# EasyEDA Pro project ProPrj_封装大全尺子_2024-08-22_20-28-28_2024-11-26.epro

# Schematic 封装大全尺子
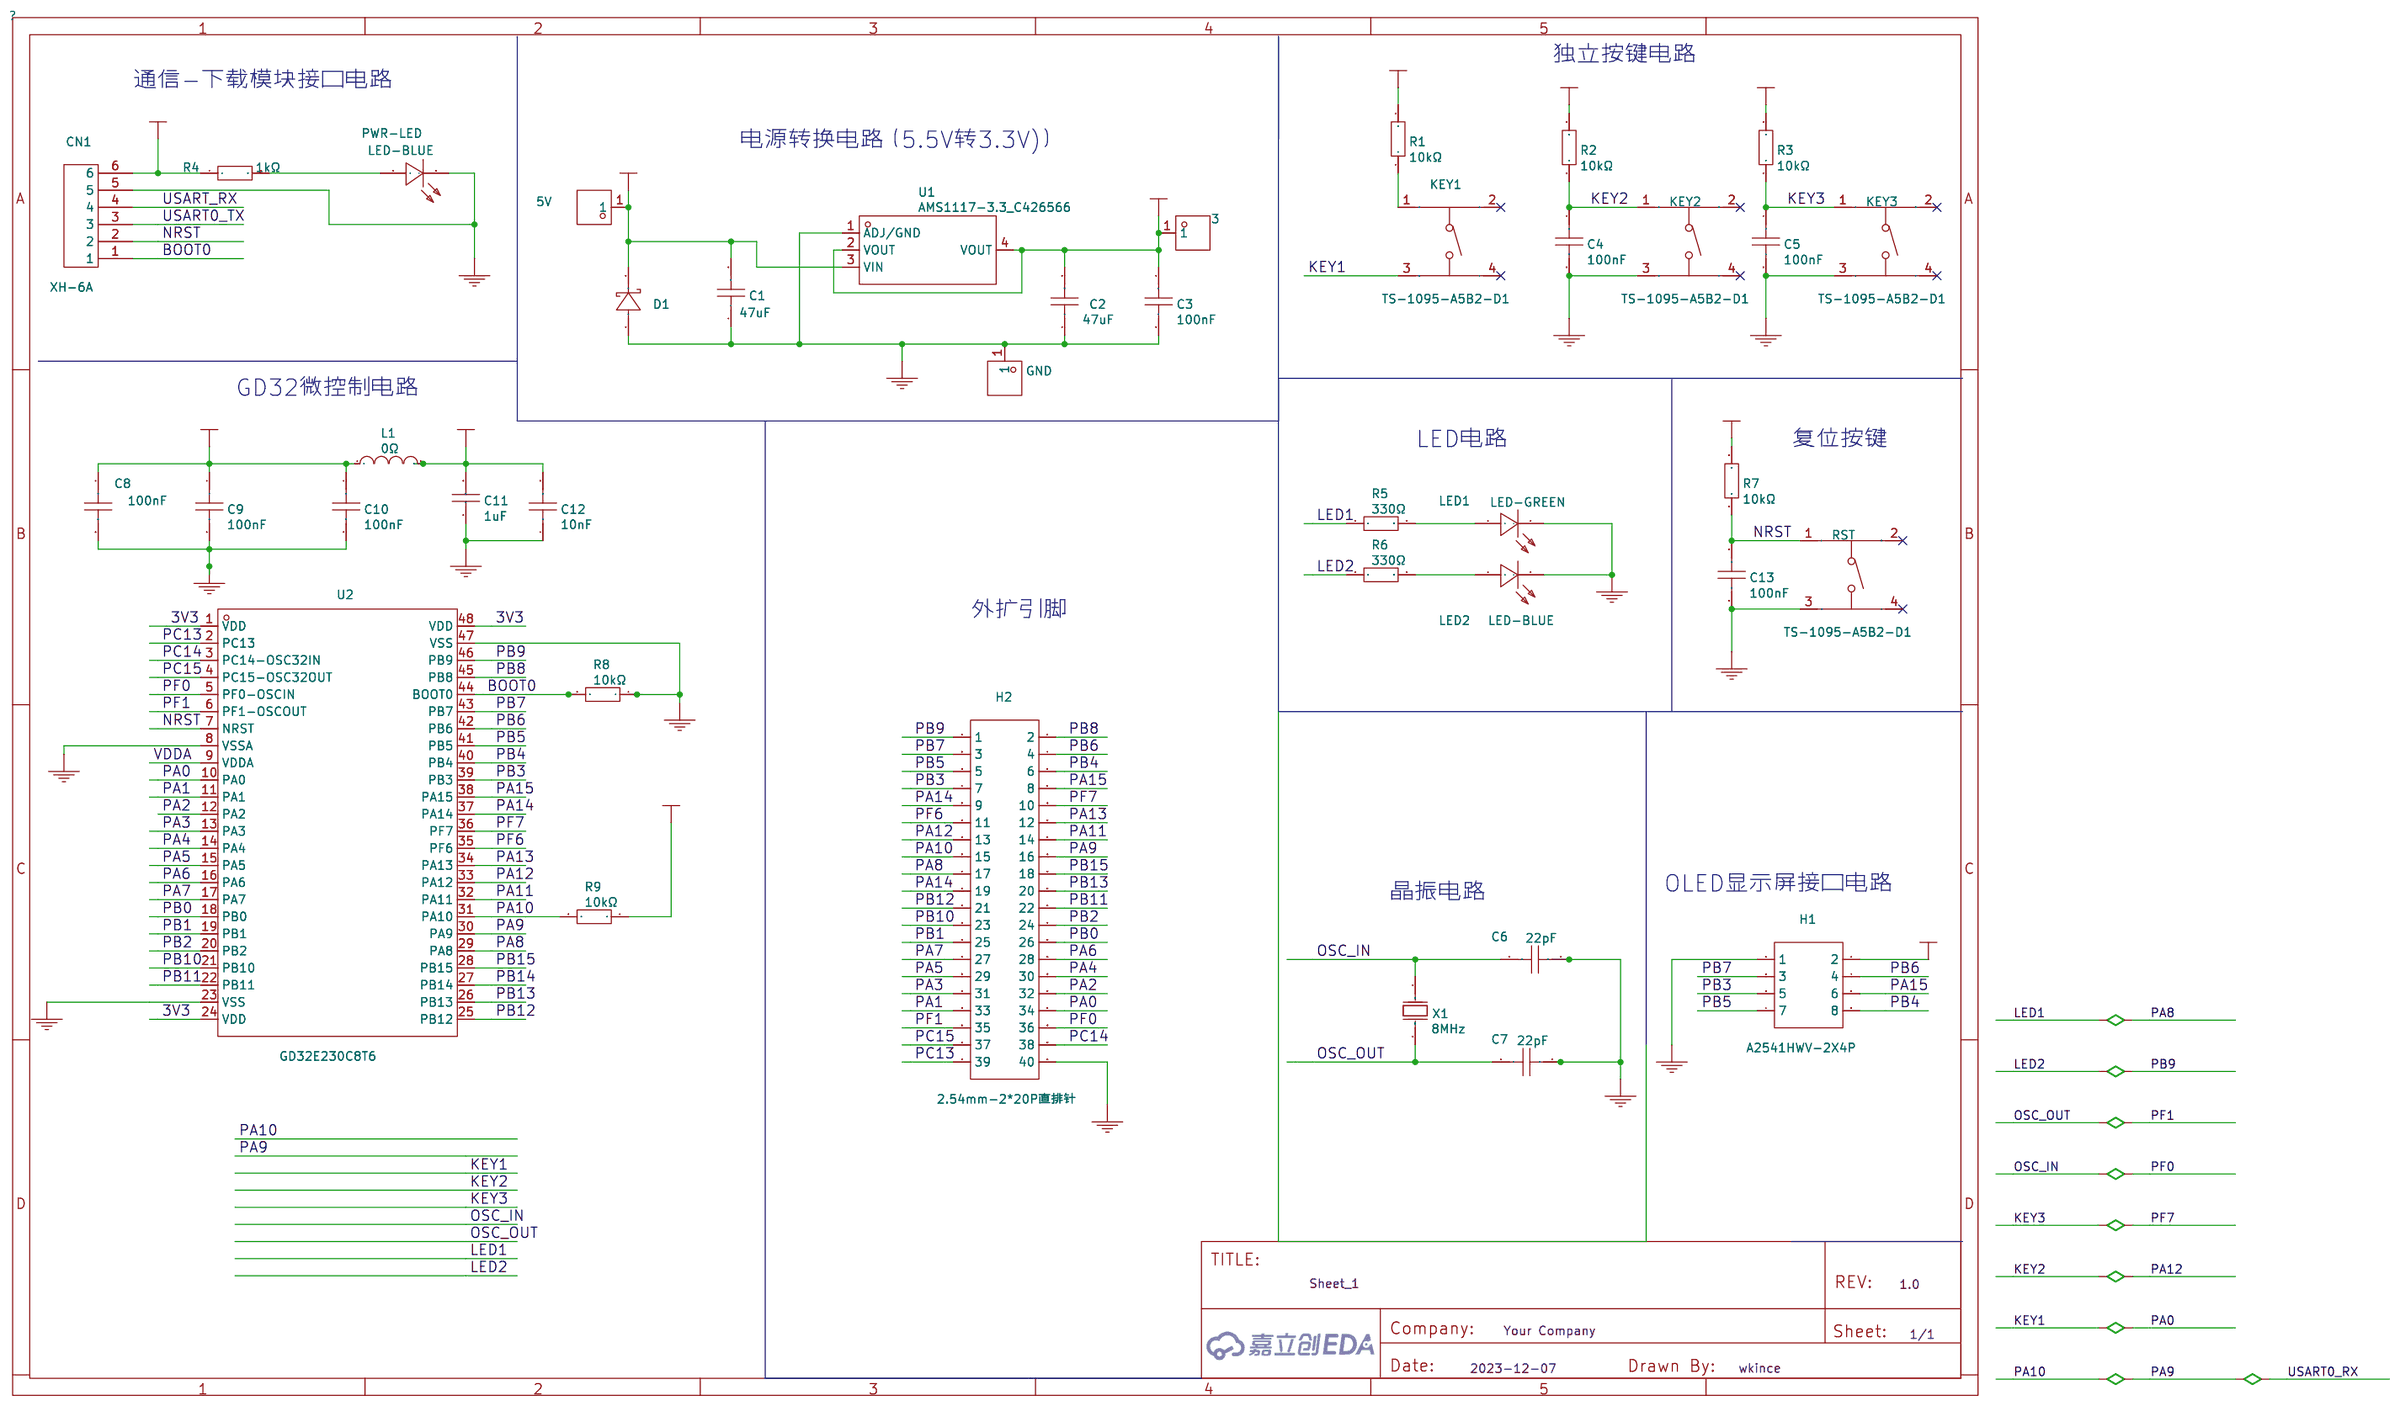
[diagram p0: schematic sheet]

## Parts
3  5010
5V  5010
C1  47uF
C2  47uF
C3  100nF
C4  100nF
C5  100nF
C6  22pF
C7  22pF
C8  100nF
C9  100nF
C10  100nF
C11  1uF
C12  10nF
C13  100nF
CN1  XH-6A
D1  SMAJ5.0A-M3/5A
GND  5010
H1  A2541HWV-2X4P
H2  2.54mm-2*20P直排针
KEY1  TS-1095-A5B2-D1
KEY2  TS-1095-A5B2-D1
KEY3  TS-1095-A5B2-D1
L1  0Ω
LED1  LED-GREEN
LED2  LED-BLUE
PWR-LED  LED-BLUE
R1  10kΩ  [R0603]
R2  10kΩ  [R0603]
R3  10kΩ  [R0603]
R4  1kΩ  [R0603]
R5  330Ω  [R0603]
R6  330Ω  [R0603]
R7  10kΩ  [R0603]
R8  10kΩ  [R0603]
R9  10kΩ  [R0603]
RST  TS-1095-A5B2-D1
U1  AMS1117-3.3_C426566
U2  GD32E230C8T6  [LQFP-48_L7.0-W7.0-P0.50-LS9.0-BL]
X1  8MHz

## Library data of the parts
3 5V GND = 5010: Supplier: LCSC; Supplier Part: C2906765; Manufacturer: Keystone; JLCPCB Part Class: Extended Part; link: https://so.szlcsc.com/global.html?k=C2906765&amp;ref=editor
C1 C2 = 47uF: Supplier: LCSC; Supplier Part: C385047; Manufacturer: muRata(村田); Manufacturer Part: GRM31CR61C476ME44L; JLCPCB Part Class: Extended Part; link: https://so.szlcsc.com/global.html?k=C385047&amp;ref=editor
C3 C8-C10 = 100nF: Supplier: LCSC; Manufacturer: YAGEO(国巨); Manufacturer Part: CC0603KRX7R9BB104; Supplier Part: C14663; JLCPCB Part Class: Basic Part; link: https://so.szlcsc.com/global.html?k=C14663&amp;ref=editor
C4 C5 C13 = 100nF: Supplier: LCSC; Manufacturer: TDK; Manufacturer Part: FA26C0G1H104JNU06; Supplier Part: C1640060; JLCPCB Part Class: Extended Part; link: https://so.szlcsc.com/global.html?k=C1640060&amp;ref=editor
C6 C7 = 22pF: Supplier: LCSC; Manufacturer: FH(风华); Manufacturer Part: 0603CG220J500NT; Supplier Part: C91701; JLCPCB Part Class: Extended Part; link: https://so.szlcsc.com/global.html?k=C91701&amp;ref=editor
C11 = 1uF: Supplier: LCSC; Manufacturer Part: CC0603KRX5R8BB105; Manufacturer: YAGEO(国巨); Supplier Part: C14664; JLCPCB Part Class: Extended Part; link: https://so.szlcsc.com/global.html?k=C14664&amp;ref=editor
C12 = 10nF: Supplier: LCSC; Supplier Part: C149618; Manufacturer: YAGEO(国巨); Manufacturer Part: AC0603KRX7R9BB103; JLCPCB Part Class: Extended Part; link: https://so.szlcsc.com/global.html?k=C149618&amp;ref=editor
CN1 = XH-6A: Supplier: LCSC; Manufacturer: BOOMELE(博穆精密); Supplier Part: C5663; JLCPCB Part Class: Extended Part; link: https://so.szlcsc.com/global.html?k=C5663&amp;ref=editor
D1 = SMAJ5.0A-M3/5A: Supplier: LCSC; Supplier Part: C1979411; Manufacturer: VISHAY(威世); JLCPCB Part Class: Extended Part; link: https://so.szlcsc.com/global.html?k=C1979411&amp;ref=editor
H1 = A2541HWV-2X4P: Supplier: LCSC; Supplier Part: C239344; Manufacturer: CJT(长江连接器); Manufacturer Part: A2541HWV-2x4P; JLCPCB Part Class: Extended Part; link: https://so.szlcsc.com/global.html?k=C239344&amp;ref=editor
H2 = 2.54mm-2*20P直排针: Supplier: LCSC; Manufacturer: BOOMELE(博穆精密); Manufacturer Part: 2.54mm 2*20P直排针; Supplier Part: C50980; JLCPCB Part Class: Extended Part; link: https://so.szlcsc.com/global.html?k=C50980&amp;ref=editor
KEY1-KEY3 RST = TS-1095-A5B2-D1: Supplier: LCSC; Supplier Part: C782808; Manufacturer: Yuandi(元迪); JLCPCB Part Class: Extended Part; link: https://so.szlcsc.com/global.html?k=C782808&amp;ref=editor
L1 = 0Ω: Supplier: LCSC; Manufacturer: FH(风华); Manufacturer Part: CBG160808U000T; Supplier Part: C43163; JLCPCB Part Class: Extended Part; link: https://so.szlcsc.com/global.html?k=C43163&amp;ref=editor
LED1 = LED-GREEN: Supplier: LCSC; Supplier Part: C434435; Manufacturer: yongyu(永裕光电); Manufacturer Part: SZYY0805YG; JLCPCB Part Class: Extended Part; link: https://so.szlcsc.com/global.html?k=C434435&amp;ref=editor
LED2 PWR-LED = LED-BLUE: Supplier: LCSC; Manufacturer: 国星光电; Manufacturer Part: NCD0805B2; Supplier Part: C84259; JLCPCB Part Class: Extended Part; link: https://so.szlcsc.com/global.html?k=C84259&amp;ref=editor
R1-R3 R7-R9 = 10kΩ: Supplier: LCSC; Manufacturer: UNI-ROYAL(厚声); Manufacturer Part: 0603WAF1002T5E; Supplier Part: C25804; JLCPCB Part Class: Basic Part; link: https://so.szlcsc.com/global.html?k=C25804&amp;ref=editor
R4 = 1kΩ: Supplier: LCSC; Manufacturer: UNI-ROYAL(厚声); Manufacturer Part: 0603WAF1001T5E; Supplier Part: C21190; JLCPCB Part Class: Basic Part; link: https://so.szlcsc.com/global.html?k=C21190&amp;ref=editor
R5 R6 = 330Ω: Supplier: LCSC; Manufacturer: UNI-ROYAL(厚声); Manufacturer Part: 0603WAF3300T5E; Supplier Part: C23138; JLCPCB Part Class: Basic Part; link: https://so.szlcsc.com/global.html?k=C23138&amp;ref=editor
U1 = AMS1117-3.3_C426566: Supplier: LCSC; Supplier Part: C426566; Manufacturer: Slkor(萨科微); Manufacturer Part: AMS1117-3.3; JLCPCB Part Class: Extended Part; link: https://so.szlcsc.com/global.html?k=C426566&amp;ref=editor
U2 = GD32E230C8T6: Supplier: LCSC; Supplier Part: C380535; Manufacturer: GigaDevice(兆易创新); JLCPCB Part Class: Extended Part; link: https://so.szlcsc.com/global.html?k=C380535&amp;ref=editor
X1 = 8MHz: Supplier: LCSC; Manufacturer: YXC(扬兴晶振); Manufacturer Part: X49SM8MSD2SC; Supplier Part: C12674; JLCPCB Part Class: Basic Part; link: https://so.szlcsc.com/global.html?k=C12674&amp;ref=editor

## Nets
3.3V: C8.1 C9.1 C10.1 L1.1 R1.2 R2.2 R3.2 R7.2 R9.1
3V3: U2.1(VDD) U2.24(VDD) U2.48(VDD)
+3.3V: 3.1 C2.2 C3.1 U1.2(VOUT) U1.4(VOUT)
+5V: 5V.1 C1.2 CN1.6 D1.2(K) H1.2 R4.1 U1.3(VIN)
GND: C1.1 C2.1 C3.2 C4.2 C5.2 C6.2 C7.2 C8.2 C9.2 C10.2 C11.1 C12.1 C13.2 CN1.5 D1.1(A) GND.1 H1.1 H2.40 KEY2.3 KEY3.3 LED1.2(-) LED2.2(-) PWR-LED.2(-) R8.1 RST.3 U1.1(ADJ/GND) U2.8(VSSA) U2.23(VSS) U2.47(VSS)
VDDA: C11.2 C12.2 L1.2 U2.9(VDDA)
BOOT0: CN1.1 R8.2 U2.44(BOOT0)
KEY1: H2.34 KEY1.3 U2.10(PA0)
KEY2: C4.1 H2.13 KEY2.1 R2.1 U2.33(PA12)
KEY3: C5.1 H2.10 KEY3.1 R3.1 U2.36(PF7)
LED1: H2.17 R5.1 U2.29(PA8)
LED2: H2.1 R6.1 U2.46(PB9)
NRST: C13.1 CN1.2 R7.1 RST.1 U2.7(NRST)
OSC_IN: C6.1 H2.36 U2.5(PF0-OSCIN) X1.1(OSC1)
OSC_OUT: C7.1 H2.35 U2.6(PF1-OSCOUT) X1.2(OSC2)
PA1: H2.33 U2.11(PA1)
PA2: H2.32 U2.12(PA2)
PA3: H2.31 U2.13(PA3)
PA4: H2.30 U2.14(PA4)
PA5: H2.29 U2.15(PA5)
PA6: H2.28 U2.16(PA6)
PA7: H2.27 U2.17(PA7)
PA10: H2.15 H2.16 R9.2 U2.30(PA9) U2.31(PA10)
PA11: H2.14 U2.32(PA11)
PA13: H2.12 U2.34(PA13)
PA14: H2.9 H2.19 U2.37(PA14)
PA15: H1.6 H2.8 U2.38(PA15)
PB0: H2.26 U2.18(PB0)
PB1: H2.25 U2.19(PB1)
PB2: H2.24 U2.20(PB2)
PB3: H1.5 H2.7 U2.39(PB3)
PB4: H1.8 H2.6 U2.40(PB4)
PB5: H1.7 H2.5 U2.41(PB5)
PB6: H1.4 H2.4 U2.42(PB6)
PB7: H1.3 H2.3 U2.43(PB7)
PB8: H2.2 U2.45(PB8)
PB10: H2.23 U2.21(PB10)
PB11: H2.22 U2.22(PB11)
PB12: H2.21 U2.25(PB12)
PB13: H2.20 U2.26(PB13)
PB14: U2.27(PB14)
PB15: H2.18 U2.28(PB15)
PC13: H2.39 U2.2(PC13)
PC14: H2.38 U2.3(PC14-OSC32IN)
PC15: H2.37 U2.4(PC15-OSC32OUT)
PF6: H2.11 U2.35(PF6)
USART0_TX: CN1.3
USART_RX: CN1.4
Net-(KEY1-1): KEY1.1 R1.1
Net-(LED1-1): LED1.1(+) R5.2
Net-(LED2-1): LED2.1(+) R6.2
Net-(PWR-LED-1): PWR-LED.1(+) R4.2

Not connected (* = marked no-connect by the designer): KEY1 2* 4*; KEY2 2* 4*; KEY3 2* 4*; RST 2* 4*

## Notes on the sheet
- 独立按键电路
- 通信-下载模块接口电路
- 电源转换电路（5.5V转3.3V)）
- GD32微控制电路
- LED电路
- 复位按键
- 外扩引脚
- OLED显示屏接口电路
- 晶振电路

# Board PCB常见封装卡
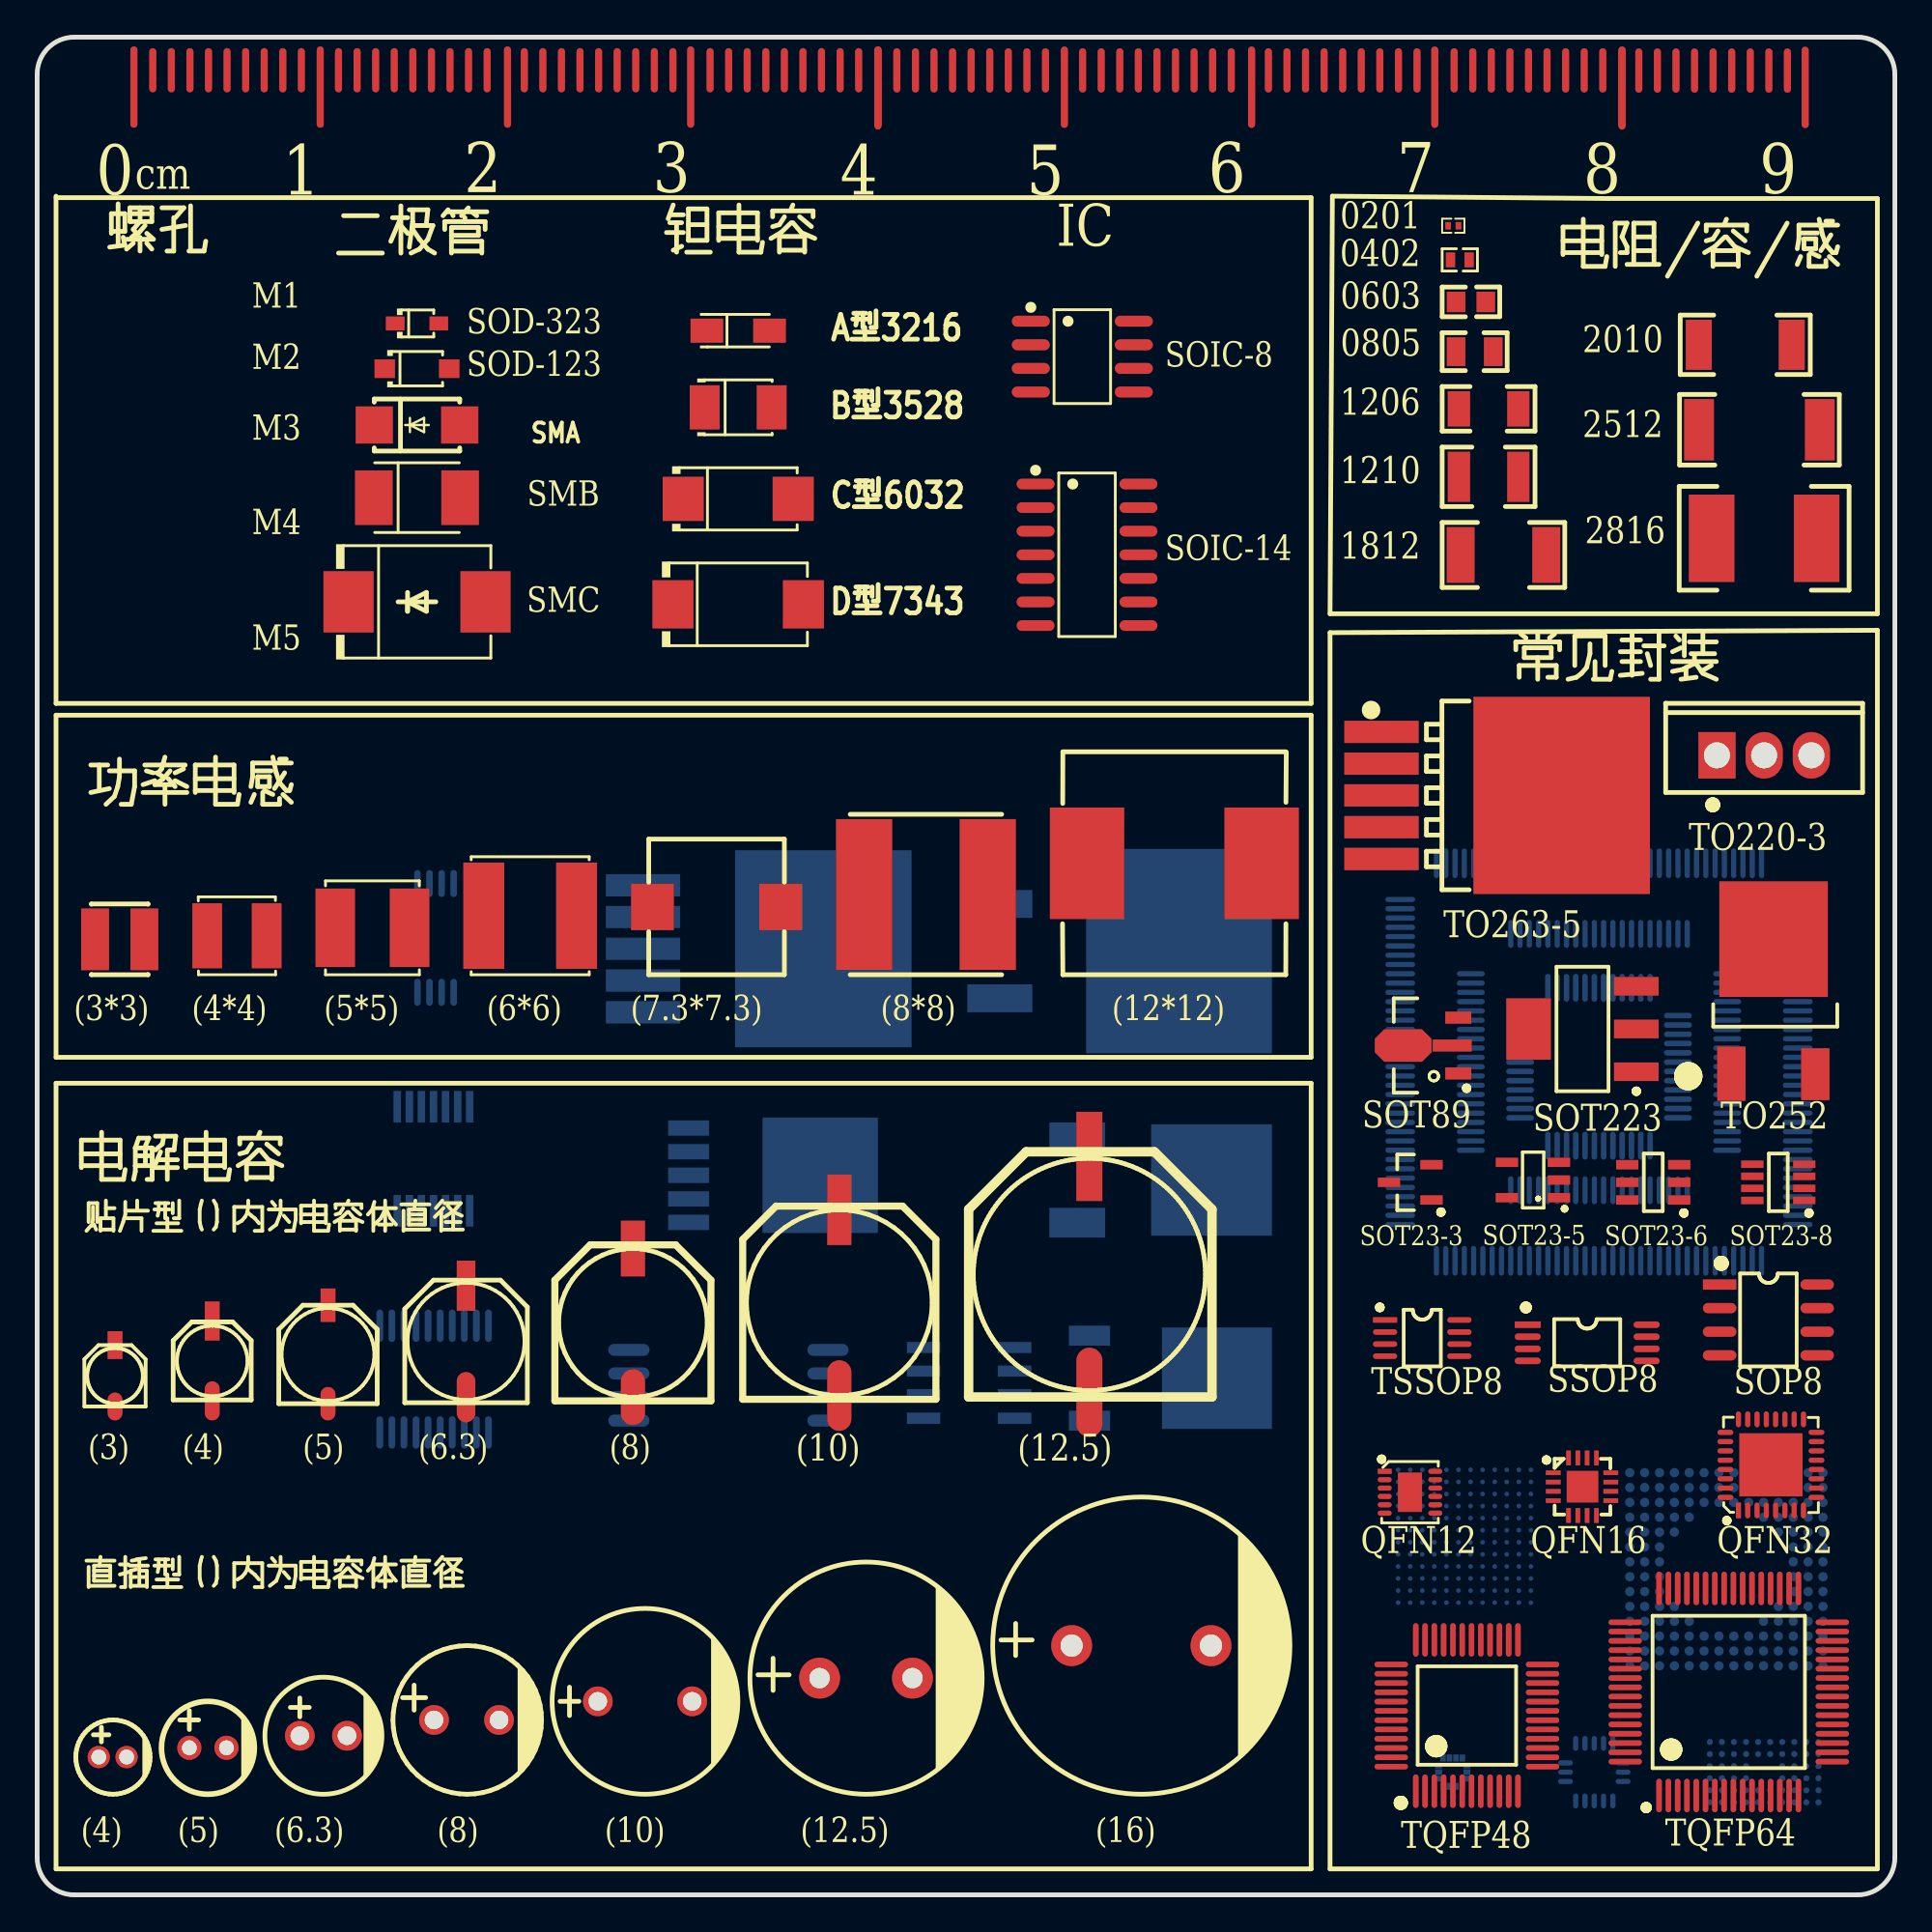
[diagram p1: board, top side]
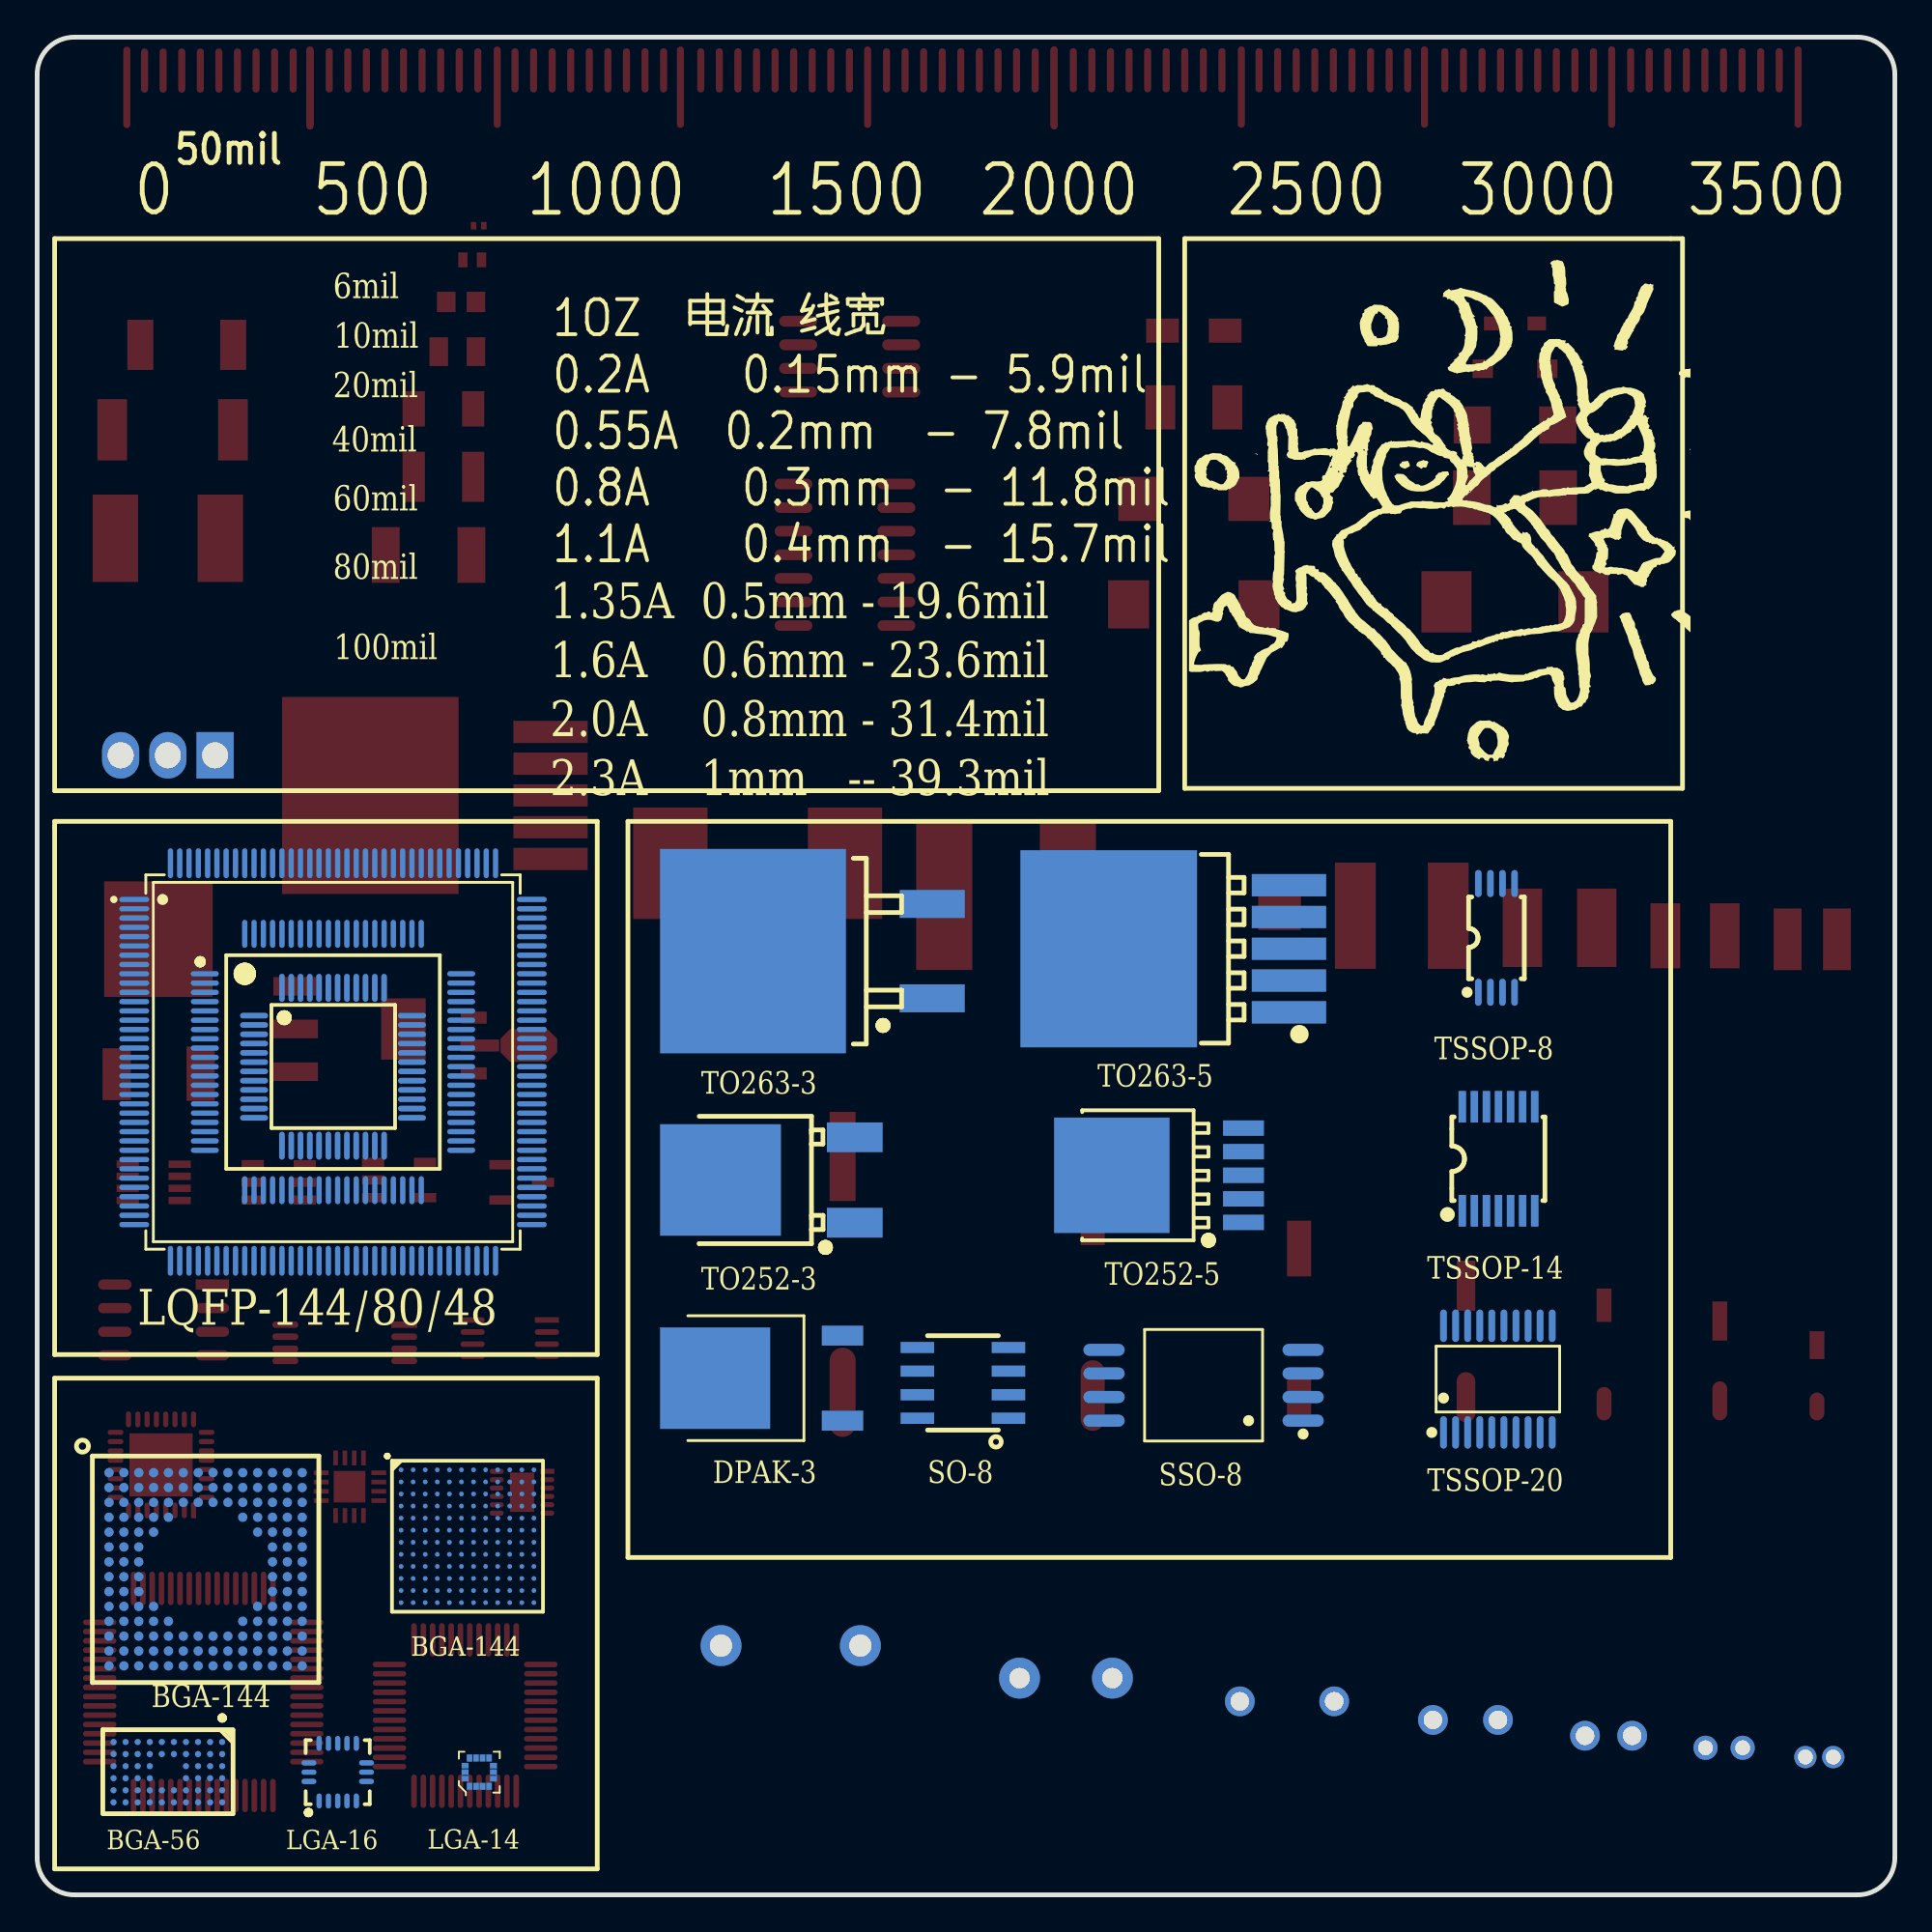
[diagram p2: board, bottom side, seen from below]

Outline 100 x 100 mm; copper layers: Top Layer, Bottom Layer. Coordinates in mm from the lower left corner of the outline.
Outline path: 0,98 arc(0.59,99.41) 2,100 98,100 arc(99.41,99.41) 100,98 100,2 arc(99.41,0.59) 98,0 2,0 arc(0.59,0.59) 0,2 0,98
Stack: Top Layer 0.035mm / Dielectric1 1.51mm FR4 er 4.5 / Bottom Layer 0.035mm

## Design rules (mm)
spacing Default (default): track to track 0.152, other pairs 0 to 0.152
track width Default (default): min 0.254, default 0.254, max 25.4
differential pair differentialPair (default): width min 0.127, default 0.254, max 2.54; gap min 0.152, default 0.152
via Default (default): diameter min 0.61, default 0.61, max 100.025; hole min 0.305, default 0.305, max 59.995
net GND uses gge54560
pour e377 uses gge54563
pour e378 uses gge54560

## Placement (name value [footprint] x y rotation side)
4*7  -  [CAP-TH_BD4.0-P1.50-D0.8-FD]  4.06 7.42 0 top
BGA-56  -  [BGA-56_L4.5-W7.0]  92.96 6.6 270 bottom
BGA-144  -  [BGA144C65P12X12_800X800X95]  76.84 19.3 180 bottom
C2  47uF  [CAP-TH_BD5.0-P2.00-D0.8-FD]  9.19 7.92 0 top
C3  100nF  [CAP-TH_BD6.3-P2.50-D1.0-FD]  15.41 8.57 0 top
C4  100nF  [CAP-TH_BD8.0-P3.50-D0.6-FD]  23.11 9.42 0 top
C5  100nF  [CAP-TH_BD12.5-P5.00-D0.6-FD]  44.62 11.67 0 top
C6  22pF  [CAP-TH_BD16.0-P7.50-D1.2-FD]  59.44 13.42 0 top
C7  22pF  [CAP-SMD_L3.2-W1.6-RD-C7171]  37.74 84.2 0 top
C8  100nF  [CAP-SMD_L3.5-W2.8]  37.74 80.07 180 top
C9  100nF  [CAP-SMD_L6.0-W3.2-R-RD]  37.74 75.15 180 top
C10  100nF  [CAP-SMD_L7.3-W4.3-R-RD]  37.74 69.47 180 top
D1  SMAJ5.0A-M3/5A  [DO-214AC_L4.3-W2.7-LS5.3-RD]  20.45 79.12 0 top
D2  -  [SOD-323_L1.8-W1.3-LS2.5-RD]  20.45 84.59 0 top
DESIGNATOR59  Comment  [CM A(3*5.4)]  4.19 27.94 270 top
DESIGNATOR60  Comment  [CM B(4*5.4)]  9.42 28.74 270 top
DESIGNATOR61  Comment  [CM C(5*5.4)]  15.66 29.09 270 top
DESIGNATOR62  Comment  [CM D(6.3*5.4)]  23.09 29.79 270 top
DESIGNATOR63  Comment  [CM E(8*10.2)]  32.07 30.79 270 top
DESIGNATOR64  Comment  [CM F(10*10.2)]  43.18 31.88 270 top
DESIGNATOR65  Comment  [CM G(12.5*13.5)]  56.64 33.4 270 top
DESIGNATOR66  Comment  [SOT23-3N]  73.91 38.35 270 top
DESIGNATOR67  Comment  [SOT23-5N]  80.52 38.48 270 top
DESIGNATOR68  Comment  [SOT23-6N]  87 38.35 270 top
DESIGNATOR69  Comment  [SOT23-8N]  93.73 38.35 270 top
DESIGNATOR70  Comment  [SOT89_N]  74.55 45.72 270 top
DESIGNATOR71  Comment  [SOT223_N]  83.19 46.61 0 top
DESIGNATOR72  Comment  [SSOP8_N]  83.44 29.72 180 top
DESIGNATOR73  Comment  [TO252]  93.47 47.24 180 top
DESIGNATOR74  Comment  [SOP8_N]  93.19 30.95 180 top
DESIGNATOR76  Comment  [TQFP48 7X7_N]  76.96 9.65 180 top
DESIGNATOR77  Comment  [TSSOP8_N]  74.56 29.97 180 top
DESIGNATOR79  Comment  [QFN32 5X5_N]  93.33 23.15 180 top
DESIGNATOR80  Comment  [QFN16_3*3]  83.19 21.97 180 top
DESIGNATOR84  Comment  [TQFP64 10X10_N]  91.06 10.92 180 top
DESIGNATOR85  Comment  [QFN12 3X3_N]  73.9 21.67 90 top
L1  0Ω  [IND-SMD_L4.0-W4.0]  10.75 51.63 0 top
L2  -  [IND-SMD_L12.0-W12.0-A]  61.21 55.53 0 top
L3  -  [IND-SMD_L6.0-W6.0]  26.54 52.71 0 top
L4  -  [IND-SMD_L3.0-W3.0]  4.44 51.44 0 top
L5  -  [IND-SMD_L8.0-W8.0]  47.84 53.85 0 top
L6  -  [IND-SMD_L7.3-W7.3]  36.57 53.18 0 top
L7  -  [IND-SMD_L5.0-W5.0]  18.05 52.06 0 top
LGA-14  -  [LGA-14_L2.0-W2.0-P0.35-BL]  76.2 6.6 180 bottom
LGA-16  -  [LGA-16_L3.0-W3.0-P0.50-BL]  83.82 6.6 180 bottom
Q1  -  [PG-TO263-3_L10.3-W9.4-P2.54-BR]  56.64 50.8 180 bottom
R1  10kΩ  [R0402]  76.58 88.01 0 top
R10  -  [R0603]  77.18 85.75 0 top
R11  -  [R0805]  77.38 83.07 0 top
R12  -  [R1206]  78.13 79.99 0 top
R13  -  [R1210]  78.13 76.33 0 top
R14  -  [R1812]  78.93 72.13 0 top
R15  -  [R2010]  91.95 83.44 0 top
R16  -  [R2512]  92.71 78.87 180 top
R17  -  [R0201]  76.23 89.85 0 top
REF1  -  [CAP-TH_BD10.0-P5.00-D1.0-FD]  32.72 10.42 0 top
RES1  -  [RES-SMD_L7.1-W4.2]  92.96 73.03 0 top
U1  AMS1117-3.3_C426566  [TO-263-5_L10.2-W9.2-P1.70-LS15.2-TL]  77.22 59.18 0 top
U2  GD32E230C8T6  [PG-TO220-3_L10.0-W4.5-P2.54-L]  92.96 61.34 0 top
U3  -  [DO-214AA_L4.4-W3.6-LS5.3-RD]  20.45 75.21 0 top
U4  -  [DO-214AB_L6.9-W5.9-LS7.9-RD]  20.45 69.6 0 top
U5  -  [SOD-123F_L2.7-W1.6-LS3.8-RD]  20.45 82.15 0 top
U6  -  [SOIC-8_L4.9-W3.9-P1.27-LS6.0-BL]  56.26 82.8 270 top
U7  -  [SOIC-14_L8.7-W3.9-P1.27-LS6.0-BL]  56.51 72.14 270 top
U8  -  [LQFP-80_L12.0-W12.0-P0.50-BL-EP]  84.07 44.83 270 bottom
U9  -  [LQFP-48_L7.0-W7.0-P0.50-LS9.0-BL]  84.07 44.58 270 bottom
U10  -  [LQFP-144_L20.0-W20.0-P0.50-LS22.0-BL]  84.07 44.83 270 bottom
U11  -  [PG-TO252-3_L6.3-W6.5-P4.57-LS10.0-BR-CW]  59.6 38.48 180 bottom
U12  -  [BGA-144_L12.1-W12.1-P0.80-BR_TMS320C5535AZHHA10]  90.93 17.53 0 bottom
U13  -  [DPAK-3_L6.6-W6.1-P2.28-LS9.9-BR]  60.08 27.81 180 bottom
U14  -  [SO-8_L4.9-W3.9-P1.27-LS6.0-BL]  50.16 27.56 90 bottom
U15  -  [SSO-8_L5.9-W6.8-P1.27-LS11.5-BL]  37.21 27.43 90 bottom
U16  -  [TO-263-5_L10.2-W9.2-P1.70-LS15.2-TL]  37.47 50.93 0 bottom
U17  -  [TO-252-5_L6.6-W5.8-P1.27-TL]  38.61 38.73 0 bottom
U18  -  [TSSOP-20_L6.5-W4.4-P0.65-LS6.4-BL]  21.37 27.76 180 bottom
U19  -  [TSSOP-8_L4.4-W3.0-P0.65-LS6.4-BL]  21.44 51.51 180 bottom
U20  -  [TSSOP-14_L5.0-W4.4-P0.65-LS6.4-BL]  21.34 39.62 180 bottom

## Footprints (pads in the part's own frame, mm; a bottom-side part is the same pattern mirrored in y, then rotated)
BGA144C65P12X12_800X800X95
  round 0.25 smd: A1(-3.575,3.575) A2(-2.925,3.575) A3(-2.275,3.575) A4(-1.625,3.575) A5(-0.975,3.575) A6(-0.325,3.575) A7(0.325,3.575) A8(0.975,3.575) A9(1.625,3.575) A10(2.275,3.575) A11(2.925,3.575) A12(3.575,3.575) B1(-3.575,2.925) B2(-2.925,2.925) B3(-2.275,2.925) B4(-1.625,2.925) B5(-0.975,2.925) B6(-0.325,2.925) B7(0.325,2.925) B8(0.975,2.925) B9(1.625,2.925) B10(2.275,2.925) B11(2.925,2.925) B12(3.575,2.925) C1(-3.575,2.275) C2(-2.925,2.275) C3(-2.275,2.275) C4(-1.625,2.275) C5(-0.975,2.275) C6(-0.325,2.275) C7(0.325,2.275) C8(0.975,2.275) C9(1.625,2.275) C10(2.275,2.275) C11(2.925,2.275) C12(3.575,2.275) D1(-3.575,1.625) D2(-2.925,1.625) D3(-2.275,1.625) D4(-1.625,1.625) D5(-0.975,1.625) D6(-0.325,1.625) D7(0.325,1.625) D8(0.975,1.625) D9(1.625,1.625) D10(2.275,1.625) D11(2.925,1.625) D12(3.575,1.625) E1(-3.575,0.975) E2(-2.925,0.975) E3(-2.275,0.975) E4(-1.625,0.975) E5(-0.975,0.975) E6(-0.325,0.975) E7(0.325,0.975) E8(0.975,0.975) E9(1.625,0.975) E10(2.275,0.975) E11(2.925,0.975) E12(3.575,0.975) F1(-3.575,0.325) F2(-2.925,0.325) F3(-2.275,0.325) F4(-1.625,0.325) F5(-0.975,0.325) F6(-0.325,0.325) F7(0.325,0.325) F8(0.975,0.325) F9(1.625,0.325) F10(2.275,0.325) F11(2.925,0.325) F12(3.575,0.325) G1(-3.575,-0.325) G2(-2.925,-0.325) G3(-2.275,-0.325) G4(-1.625,-0.325) G5(-0.975,-0.325) G6(-0.325,-0.325) G7(0.325,-0.325) G8(0.975,-0.325) G9(1.625,-0.325) G10(2.275,-0.325) G11(2.925,-0.325) G12(3.575,-0.325) H1(-3.575,-0.975) H2(-2.925,-0.975) H3(-2.275,-0.975) H4(-1.625,-0.975) H5(-0.975,-0.975) H6(-0.325,-0.975) H7(0.325,-0.975) H8(0.975,-0.975) H9(1.625,-0.975) H10(2.275,-0.975) H11(2.925,-0.975) H12(3.575,-0.975) J1(-3.575,-1.625) J2(-2.925,-1.625) J3(-2.275,-1.625) J4(-1.625,-1.625) J5(-0.975,-1.625) J6(-0.325,-1.625) J7(0.325,-1.625) J8(0.975,-1.625) J9(1.625,-1.625) J10(2.275,-1.625) J11(2.925,-1.625) J12(3.575,-1.625) K1(-3.575,-2.275) K2(-2.925,-2.275) K3(-2.275,-2.275) K4(-1.625,-2.275) K5(-0.975,-2.275) K6(-0.325,-2.275) K7(0.325,-2.275) K8(0.975,-2.275) K9(1.625,-2.275) K10(2.275,-2.275) K11(2.925,-2.275) K12(3.575,-2.275) L1(-3.575,-2.925) L2(-2.925,-2.925) L3(-2.275,-2.925) L4(-1.625,-2.925) L5(-0.975,-2.925) L6(-0.325,-2.925) L7(0.325,-2.925) L8(0.975,-2.925) L9(1.625,-2.925) L10(2.275,-2.925) L11(2.925,-2.925) L12(3.575,-2.925) M1(-3.575,-3.575) M2(-2.925,-3.575) M3(-2.275,-3.575) M4(-1.625,-3.575) M5(-0.975,-3.575) M6(-0.325,-3.575) M7(0.325,-3.575) M8(0.975,-3.575) M9(1.625,-3.575) M10(2.275,-3.575) M11(2.925,-3.575) M12(3.575,-3.575)
BGA-56_L4.5-W7.0
  round 0.33 smd: A1(-1.625,2.922) A2(-0.974,2.925) A3(-0.324,2.925) A4(0.327,2.925) A5(0.977,2.925) A6(1.625,2.925) B1(-1.625,2.275) B2(-0.974,2.275) B3(-0.324,2.275) B4(0.327,2.275) B5(0.977,2.275) B6(1.625,2.275) C1(-1.625,1.625) C2(-0.974,1.625) C3(-0.324,1.625) C4(0.327,1.625) C5(0.977,1.625) C6(1.625,1.625) D1(-1.625,0.974) D2(-0.974,0.974) D3(-0.324,0.974) D4(0.327,0.974) D5(0.977,0.974) D6(1.625,0.974) E1(-1.625,0.324) E2(-0.974,0.324) E5(0.977,0.324) E6(1.625,0.324) F1(-1.625,-0.324) F2(-0.974,-0.324) F5(0.977,-0.324) F6(1.625,-0.324) G1(-1.625,-0.974) G2(-0.974,-0.974) G3(-0.324,-0.974) G4(0.327,-0.974) G5(0.977,-0.974) G6(1.625,-0.974) H1(-1.625,-1.625) H2(-0.974,-1.625) H3(-0.324,-1.625) H4(0.327,-1.625) H5(0.977,-1.625) H6(1.625,-1.625) J1(-1.625,-2.275) J2(-0.974,-2.275) J3(-0.324,-2.275) J4(0.327,-2.275) J5(0.977,-2.275) J6(1.625,-2.275) K1(-1.625,-2.925) K2(-0.974,-2.925) K3(-0.324,-2.925) K4(0.327,-2.925) K5(0.977,-2.925) K6(1.625,-2.925)
BGA-144_L12.1-W12.1-P0.80-BR_TMS320C5535AZHHA10
  round 0.5 smd: A1(5.2,-5.2) A2(4.4,-5.2) A3(3.6,-5.2) A4(2.8,-5.2) A5(2.001,-5.2) A6(1.2,-5.2) A7(0.4,-5.2) A8(-0.4,-5.2) A9(-1.2,-5.2) A10(-2,-5.2) A11(-2.8,-5.2) A12(-3.599,-5.2) A13(-4.4,-5.2) A14(-5.2,-5.2) B1(5.2,-4.4) B2(4.4,-4.4) B3(3.6,-4.4) B4(2.8,-4.4) B5(2.001,-4.4) B6(1.2,-4.4) B7(0.4,-4.4) B8(-0.4,-4.4) B9(-1.2,-4.4) B10(-2,-4.4) B11(-2.8,-4.4) B12(-3.599,-4.4) B13(-4.4,-4.4) B14(-5.2,-4.4) C1(5.2,-3.6) C2(4.4,-3.6) C3(3.6,-3.6) C4(2.8,-3.6) C5(2.001,-3.6) C6(1.2,-3.6) C7(0.4,-3.6) C8(-0.4,-3.6) C9(-1.2,-3.6) C10(-2,-3.6) C11(-2.8,-3.6) C12(-3.599,-3.6) C13(-4.4,-3.6) C14(-5.2,-3.6) D1(5.2,-2.8) D2(4.4,-2.8) D3(3.6,-2.8) D4(2.8,-2.8) D5(2.001,-2.8) D10(-2,-2.8) D11(-2.8,-2.8) D12(-3.599,-2.8) D13(-4.4,-2.8) D14(-5.2,-2.8) E1(5.2,-2.001) E2(4.4,-2.001) E3(3.6,-2.001) E4(2.8,-2.001) E11(-2.8,-2.001) E12(-3.599,-2.001) E13(-4.4,-2.001) E14(-5.2,-2.001) F1(5.2,-1.2) F2(4.4,-1.2) F3(3.6,-1.2) F12(-3.599,-1.2) F13(-4.4,-1.2) F14(-5.2,-1.2) G1(5.2,-0.4) G2(4.4,-0.4) G3(3.6,-0.4) G12(-3.599,-0.4) G13(-4.4,-0.4) G14(-5.2,-0.4) H1(5.2,0.4) H2(4.4,0.4) H3(3.6,0.4) H12(-3.599,0.4) H13(-4.4,0.4) H14(-5.2,0.4) J1(5.2,1.2) J2(4.4,1.2) J3(3.6,1.2) J12(-3.599,1.2) J13(-4.4,1.2) J14(-5.2,1.2) K1(5.2,2) K2(4.4,2) K3(3.6,2) K4(2.8,2) K11(-2.8,2) K12(-3.599,2) K13(-4.4,2) K14(-5.2,2) L1(5.2,2.8) L2(4.4,2.8) L3(3.6,2.8) L4(2.8,2.8) L5(2.001,2.8) L10(-2,2.8) L11(-2.8,2.8) L12(-3.599,2.8) L13(-4.4,2.8) L14(-5.2,2.8) M1(5.2,3.6) M2(4.4,3.6) M3(3.6,3.6) M4(2.8,3.6) M5(2.001,3.6) M6(1.2,3.6) M7(0.4,3.6) M8(-0.4,3.6) M9(-1.2,3.6) M10(-2,3.6) M11(-2.8,3.6) M12(-3.599,3.6) M13(-4.4,3.6) M14(-5.2,3.6) N1(5.2,4.4) N2(4.4,4.4) N3(3.6,4.4) N4(2.8,4.4) N5(2.001,4.4) N6(1.2,4.4) N7(0.4,4.4) N8(-0.4,4.4) N9(-1.2,4.4) N10(-2,4.4) N11(-2.8,4.4) N12(-3.599,4.4) N13(-4.4,4.4) N14(-5.2,4.4) P1(5.2,5.2) P2(4.4,5.2) P3(3.6,5.2) P4(2.8,5.2) P5(2.001,5.2) P6(1.2,5.2) P7(0.4,5.2) P8(-0.4,5.2) P9(-1.2,5.2) P10(-2,5.2) P11(-2.8,5.2) P12(-3.599,5.2) P13(-4.4,5.2) P14(-5.2,5.2)
CAP-SMD_L3.2-W1.6-RD-C7171
  rect 1.758x1.296 smd: 1(-1.687,0) 2(1.687,0)
CAP-SMD_L3.5-W2.8
  rect 1.607x2.376 smd: 1(1.804,0) 2(-1.804,0)
CAP-SMD_L6.0-W3.2-R-RD
  rect 2.208x2.376 smd: 1(2.962,0) 2(-2.961,0)
CAP-SMD_L7.3-W4.3-R-RD
  rect 2.208x2.592 smd: 1(3.511,0) 2(-3.511,0)
CAP-TH_BD4.0-P1.50-D0.8-FD
  round 1.2 hole 0.8: 1(-0.75,0) 2(0.75,0)
CAP-TH_BD5.0-P2.00-D0.8-FD
  round 1.3 hole 0.8: 1(-1,0) 2(1,0)
CAP-TH_BD6.3-P2.50-D1.0-FD
  round 1.6 hole 1: 1(-1.27,0) 2(1.27,0)
CAP-TH_BD8.0-P3.50-D0.6-FD
  round 1.6 hole 1: 1(-1.75,0) 2(1.75,0)
CAP-TH_BD10.0-P5.00-D1.0-FD
  round 1.6 hole 1: 1(-2.54,0) 2(2.54,0)
CAP-TH_BD12.5-P5.00-D0.6-FD
  round 2.2 hole 1.1: 1(-2.5,0) 2(2.5,0)
CAP-TH_BD16.0-P7.50-D1.2-FD
  round 2.2 hole 1.2: 1(-3.75,0) 2(3.75,0)
CM A(3*5.4)
  rect 1.5x0.8 smd: 1(-1.651,0)
  oval 1.5x0.8 smd: 2(1.65,0)
CM B(4*5.4)
  rect 2.1x0.8 smd: 1(-2.15,0)
  oval 2.1x0.8 smd: 2(2.15,0)
CM C(5*5.4)
  rect 1.8x0.8 smd: 1(-2.65,0)
  oval 1.8x0.8 smd: 2(2.65,0)
CM D(6.3*5.4)
  rect 2.7x1 smd: 1(-3,0)
  oval 2.7x1 smd: 2(3,0)
CM E(8*10.2)
  rect 3x1.3 smd: 1(-4,0)
  oval 3x1.3 smd: 2(4,0)
CM F(10*10.2)
  rect 3.8x1.3 smd: 1(-5,0)
  oval 3.8x1.3 smd: 2(5,0)
CM G(12.5*13.5)
  rect 4.8x1.4 smd: 1(-6.35,0)
  oval 4.8x1.4 smd: 2(6.35,0)
DO-214AA_L4.4-W3.6-LS5.3-RD
  rect 2.024x2.94 smd: 1(-2.322,0) 2(2.322,0)
DO-214AB_L6.9-W5.9-LS7.9-RD
  rect 2.7x3.3 smd: 1(-3.687,0) 2(3.687,0)
DO-214AC_L4.3-W2.7-LS5.3-RD
  rect 2x2 smd: 1(-2.3,0) 2(2.3,0)
DPAK-3_L6.6-W6.1-P2.28-LS9.9-BR
  rect 2.223x1.071 smd: 1(3.428,-2.29) 3(3.428,2.29)
  rect 5.925x5.46 smd: 2(-3.428,0)
IND-SMD_L3.0-W3.0
  rect 1.5x3.32 smd: 1(1.328,0) 2(-1.328,0)
IND-SMD_L4.0-W4.0
  rect 1.6x3.5 smd: 1(-1.6,0) 2(1.6,0)
IND-SMD_L5.0-W5.0
  rect 2.124x4.22 smd: 1(2,0) 2(-2,0)
IND-SMD_L6.0-W6.0
  rect 2.2x5.72 smd: 1(-2.5,0) 2(2.5,0)
IND-SMD_L7.3-W7.3
  rect 2.3x2.5 smd: 1(-3.45,0) 2(3.45,0)
IND-SMD_L8.0-W8.0
  rect 3.024x8.12 smd: 1(3.328,0) 2(-3.328,0)
IND-SMD_L12.0-W12.0-A
  rect 4x6 smd: 1(-4.7,0) 2(4.7,0)
LGA-14_L2.0-W2.0-P0.35-BL
  rect 0.3x0.375 smd: 1(-0.525,-0.762) 2(-0.175,-0.762) 3(0.176,-0.762) 4(0.525,-0.762) 8(0.525,0.762) 9(0.176,0.762) 10(-0.175,0.762)
  rect 0.375x0.3 smd: 5(0.763,-0.351) 6(0.763,-0.001) 7(0.763,0.35) 12(-0.763,0.35) 13(-0.763,-0.001) 14(-0.763,-0.351)
  rect 0.3x0.38 smd: 11(-0.525,0.762)
LGA-16_L3.0-W3.0-P0.50-BL
  oval 0.28x0.8 smd: 1(-1,-1.55) 2(-0.5,-1.55) 3(0,-1.55) 4(0.5,-1.55) 5(1,-1.55) 9(1,1.55) 10(0.5,1.55) 11(0,1.55) 12(-0.5,1.55) 13(-1,1.55)
  oval 0.8x0.28 smd: 6(1.55,-0.5) 7(1.55,0) 8(1.55,0.5) 14(-1.55,0.5) 15(-1.55,0) 16(-1.55,-0.5)
LQFP-48_L7.0-W7.0-P0.50-LS9.0-BL
  oval 0.3x1.5 smd: 1(-2.75,-4.25) 2(-2.25,-4.25) 3(-1.75,-4.25) 4(-1.25,-4.25) 5(-0.75,-4.25) 6(-0.25,-4.25) 7(0.25,-4.25) 8(0.75,-4.25) 9(1.25,-4.25) 10(1.75,-4.25) 11(2.25,-4.25) 12(2.75,-4.25) 25(2.75,4.25) 26(2.25,4.25) 27(1.75,4.25) 28(1.25,4.25) 29(0.75,4.25) 30(0.25,4.25) 31(-0.25,4.25) 32(-0.75,4.25) 33(-1.25,4.25) 34(-1.75,4.25) 35(-2.25,4.25) 36(-2.75,4.25)
  oval 1.5x0.3 smd: 13(4.25,-2.75) 14(4.25,-2.25) 15(4.25,-1.75) 16(4.25,-1.25) 17(4.25,-0.75) 18(4.25,-0.25) 19(4.25,0.25) 20(4.25,0.75) 21(4.25,1.25) 22(4.25,1.75) 23(4.25,2.25) 24(4.25,2.75) 37(-4.25,2.75) 38(-4.25,2.25) 39(-4.25,1.75) 40(-4.25,1.25) 41(-4.25,0.75) 42(-4.25,0.25) 43(-4.25,-0.25) 44(-4.25,-0.75) 45(-4.25,-1.25) 46(-4.25,-1.75) 47(-4.25,-2.25) 48(-4.25,-2.75)
LQFP-80_L12.0-W12.0-P0.50-BL-EP
  oval 0.28x1.5 smd: 1(-4.75,-6.9) 2(-4.25,-6.9) 3(-3.75,-6.9) 4(-3.25,-6.9) 5(-2.75,-6.9) 6(-2.25,-6.9) 7(-1.75,-6.9) 8(-1.25,-6.9) 9(-0.75,-6.9) 10(-0.25,-6.9) 11(0.25,-6.9) 12(0.75,-6.9) 13(1.25,-6.9) 14(1.75,-6.9) 15(2.25,-6.9) 16(2.75,-6.9) 17(3.25,-6.9) 18(3.75,-6.9) 19(4.25,-6.9) 20(4.75,-6.9) 41(4.75,6.9) 42(4.25,6.9) 43(3.75,6.9) 44(3.25,6.9) 45(2.75,6.9) 46(2.25,6.9) 47(1.75,6.9) 48(1.25,6.9) 49(0.75,6.9) 50(0.25,6.9) 51(-0.25,6.9) 52(-0.75,6.9) 53(-1.25,6.9) 54(-1.75,6.9) 55(-2.25,6.9) 56(-2.75,6.9) 57(-3.25,6.9) 58(-3.75,6.9) 59(-4.25,6.9) 60(-4.75,6.9)
  oval 1.5x0.28 smd: 21(6.9,-4.75) 22(6.9,-4.25) 23(6.9,-3.75) 24(6.9,-3.25) 25(6.9,-2.75) 26(6.9,-2.25) 27(6.9,-1.75) 28(6.9,-1.25) 29(6.9,-0.75) 30(6.9,-0.25) 31(6.9,0.25) 32(6.9,0.75) 33(6.9,1.25) 34(6.9,1.75) 35(6.9,2.25) 36(6.9,2.75) 37(6.9,3.25) 38(6.9,3.75) 39(6.9,4.25) 40(6.9,4.75) 61(-6.9,4.75) 62(-6.9,4.25) 63(-6.9,3.75) 64(-6.9,3.25) 65(-6.9,2.75) 66(-6.9,2.25) 67(-6.9,1.75) 68(-6.9,1.25) 69(-6.9,0.75) 70(-6.9,0.25) 71(-6.9,-0.25) 72(-6.9,-0.75) 73(-6.9,-1.25) 74(-6.9,-1.75) 75(-6.9,-2.25) 76(-6.9,-2.75) 77(-6.9,-3.25) 78(-6.9,-3.75) 79(-6.9,-4.25) 80(-6.9,-4.75)
LQFP-144_L20.0-W20.0-P0.50-LS22.0-BL
  oval 0.28x1.6 smd: 1(-8.75,-10.7) 2(-8.25,-10.7) 3(-7.75,-10.7) 4(-7.25,-10.7) 5(-6.75,-10.7) 6(-6.25,-10.7) 7(-5.75,-10.7) 8(-5.25,-10.7) 9(-4.75,-10.7) 10(-4.25,-10.7) 11(-3.75,-10.7) 12(-3.25,-10.7) 13(-2.75,-10.7) 14(-2.25,-10.7) 15(-1.75,-10.7) 16(-1.25,-10.7) 17(-0.75,-10.7) 18(-0.25,-10.7) 19(0.25,-10.7) 20(0.75,-10.7) 21(1.25,-10.7) 22(1.75,-10.7) 23(2.25,-10.7) 24(2.75,-10.7) 25(3.25,-10.7) 26(3.75,-10.7) 27(4.25,-10.7) 28(4.75,-10.7) 29(5.25,-10.7) 30(5.75,-10.7) 31(6.25,-10.7) 32(6.75,-10.7) 33(7.25,-10.7) 34(7.75,-10.7) 35(8.25,-10.7) 36(8.75,-10.7) 73(8.75,10.7) 74(8.25,10.7) 75(7.75,10.7) 76(7.25,10.7) 77(6.75,10.7) 78(6.25,10.7) 79(5.75,10.7) 80(5.25,10.7) 81(4.75,10.7) 82(4.25,10.7) 83(3.75,10.7) 84(3.25,10.7) 85(2.75,10.7) 86(2.25,10.7) 87(1.75,10.7) 88(1.25,10.7) 89(0.75,10.7) 90(0.25,10.7) 91(-0.25,10.7) 92(-0.75,10.7) 93(-1.25,10.7) 94(-1.75,10.7) 95(-2.25,10.7) 96(-2.75,10.7) 97(-3.25,10.7) 98(-3.75,10.7) 99(-4.25,10.7) 100(-4.75,10.7) 101(-5.25,10.7) 102(-5.75,10.7) 103(-6.25,10.7) 104(-6.75,10.7) 105(-7.25,10.7) 106(-7.75,10.7) 107(-8.25,10.7) 108(-8.75,10.7)
  oval 1.6x0.28 smd: 37(10.7,-8.75) 38(10.7,-8.25) 39(10.7,-7.75) 40(10.7,-7.25) 41(10.7,-6.75) 42(10.7,-6.25) 43(10.7,-5.75) 44(10.7,-5.25) 45(10.7,-4.75) 46(10.7,-4.25) 47(10.7,-3.75) 48(10.7,-3.25) 49(10.7,-2.75) 50(10.7,-2.25) 51(10.7,-1.75) 52(10.7,-1.25) 53(10.7,-0.75) 54(10.7,-0.25) 55(10.7,0.25) 56(10.7,0.75) 57(10.7,1.25) 58(10.7,1.75) 59(10.7,2.25) 60(10.7,2.75) 61(10.7,3.25) 62(10.7,3.75) 63(10.7,4.25) 64(10.7,4.75) 65(10.7,5.25) 66(10.7,5.75) 67(10.7,6.25) 68(10.7,6.75) 69(10.7,7.25) 70(10.7,7.75) 71(10.7,8.25) 72(10.7,8.75) 109(-10.7,8.75) 110(-10.7,8.25) 111(-10.7,7.75) 112(-10.7,7.25) 113(-10.7,6.75) 114(-10.7,6.25) 115(-10.7,5.75) 116(-10.7,5.25) 117(-10.7,4.75) 118(-10.7,4.25) 119(-10.7,3.75) 120(-10.7,3.25) 121(-10.7,2.75) 122(-10.7,2.25) 123(-10.7,1.75) 124(-10.7,1.25) 125(-10.7,0.75) 126(-10.7,0.25) 127(-10.7,-0.25) 128(-10.7,-0.75) 129(-10.7,-1.25) 130(-10.7,-1.75) 131(-10.7,-2.25) 132(-10.7,-2.75) 133(-10.7,-3.25) 134(-10.7,-3.75) 135(-10.7,-4.25) 136(-10.7,-4.75) 137(-10.7,-5.25) 138(-10.7,-5.75) 139(-10.7,-6.25) 140(-10.7,-6.75) 141(-10.7,-7.25) 142(-10.7,-7.75) 143(-10.7,-8.25) 144(-10.7,-8.75)
PG-TO220-3_L10.0-W4.5-P2.54-L
  rect 2x2.5 hole 1.4: 1(-2.54,0)
  oval 2x2.5 hole 1.4: 2(0,0) 3(2.54,0)
PG-TO252-3_L6.3-W6.5-P4.57-LS10.0-BR-CW
  rect 3x1.6 smd: 1(3.614,-2.3) 3(3.614,2.299)
  rect 6.5x6 smd: 2(-3.614,0.001)
PG-TO263-3_L10.3-W9.4-P2.54-BR
  rect 3.5x1.5 smd: 1(4.824,-2.54) 3(4.824,2.54)
  rect 10x11 smd: 4(-4.824,0)
QFN12 3X3_N
  custom 0.275x0.75 smd: 1(1.125,1.361) 2(0.675,1.361) 3(0.225,1.361) 4(-0.225,1.361) 5(-0.675,1.361) 6(-1.125,1.361) 7(-1.125,-1.362) 8(-0.675,-1.362) 9(-0.225,-1.362) 10(0.225,-1.362) 11(0.675,-1.362) 12(1.125,-1.362)
  custom 2.12x1.3 smd: 13(0,0)
QFN16_3*3
  custom 0.8x0.25 smd: 1(1.575,-0.75) 2(1.575,-0.25) 3(1.575,0.25) 4(1.575,0.75) 9(-1.524,0.75) 10(-1.524,0.25) 11(-1.524,-0.25) 12(-1.524,-0.75)
  custom 0.25x0.8 smd: 5(0.75,1.55) 6(0.25,1.55) 7(-0.25,1.55) 8(-0.75,1.55) 13(-0.75,-1.55) 14(-0.25,-1.55) 15(0.25,-1.55) 16(0.75,-1.55)
  rect 1.7x1.7 smd: 17(-0.001,0)
QFN32 5X5_N
  rect 0.275x0.85 smd: 1(1.75,2.451)
  oval 0.275x0.85 smd: 2(1.25,2.451) 3(0.75,2.451) 4(0.25,2.451) 5(-0.251,2.451) 6(-0.75,2.451) 7(-1.25,2.451) 8(-1.75,2.451) 17(-1.75,-2.451) 18(-1.25,-2.451) 19(-0.75,-2.451) 20(-0.251,-2.451) 21(0.25,-2.451) 22(0.75,-2.451) 23(1.25,-2.451) 24(1.75,-2.451)
  oval 0.85x0.275 smd: 9(-2.451,1.75) 10(-2.451,1.25) 11(-2.451,0.75) 12(-2.451,0.25) 13(-2.451,-0.25) 14(-2.451,-0.75) 15(-2.451,-1.25) 16(-2.451,-1.75) 25(2.451,-1.75) 26(2.451,-1.25) 27(2.451,-0.75) 28(2.451,-0.25) 29(2.451,0.25) 30(2.451,0.75) 31(2.451,1.25) 32(2.451,1.75)
  rect 3.4x3.4 smd: 33(0,0)
R0201
  rect 0.3x0.4 smd: 1(-0.275,0) 2(0.275,0)
R0402
  rect 0.5x0.8 smd: 1(-0.5,0) 2(0.5,0)
R0603
  rect 1x1.1 smd: 1(-0.8,0) 2(0.8,0)
R0805
  rect 1x1.55 smd: 1(-1,0) 2(1,0)
R1206
  rect 1.2x1.9 smd: 1(-1.6,0) 2(1.6,0)
R1210
  rect 1.2x2.7 smd: 1(-1.6,0) 2(1.6,0)
R1812
  rect 1.5x3 smd: 1(-2.305,0) 2(2.305,0)
R2010
  rect 1.4x2.7 smd: 1(-2.5,0) 2(2.5,0)
R2512
  rect 1.6x3.3 smd: 1(-3.25,0) 2(3.25,0)
RES-SMD_L7.1-W4.2
  rect 2.45x4.7 smd: 1(-2.825,0) 2(2.825,0)
SO-8_L4.9-W3.9-P1.27-LS6.0-BL
  rect 0.6x1.8 smd: 1(-1.905,-2.45) 2(-0.635,-2.45) 3(0.635,-2.45) 4(1.905,-2.45) 5(1.905,2.45) 6(0.635,2.45) 7(-0.635,2.45) 8(-1.905,2.45)
SOD-123F_L2.7-W1.6-LS3.8-RD
  rect 1.1x1 smd: 1(-1.735,0) 2(1.735,0)
SOD-323_L1.8-W1.3-LS2.5-RD
  rect 1x0.75 smd: 1(-1.173,0) 2(1.173,0)
SOIC-8_L4.9-W3.9-P1.27-LS6.0-BL
  oval 0.588x2.045 smd: 1(-1.905,-2.772) 2(-0.635,-2.772) 3(0.635,-2.772) 4(1.905,-2.772) 5(1.905,2.772) 6(0.635,2.772) 7(-0.635,2.772) 8(-1.905,2.772)
SOIC-14_L8.7-W3.9-P1.27-LS6.0-BL
  oval 0.574x2.038 smd: 1(-3.81,-2.769) 2(-2.54,-2.769) 3(-1.27,-2.769) 4(0,-2.769) 5(1.27,-2.769) 6(2.54,-2.769) 7(3.81,-2.769) 8(3.81,2.769) 9(2.54,2.769) 10(1.27,2.769) 11(0,2.769) 12(-1.27,2.769) 13(-2.54,2.769) 14(-3.81,2.769)
SOP8_N
  custom 1.8x0.55 smd: 1(2.625,-1.905)
  custom 1.799x0.55 smd: 2(2.625,-0.635) 3(2.625,0.635) 4(2.625,1.905) 5(-2.625,1.905) 6(-2.625,0.635) 7(-2.625,-0.635) 8(-2.625,-1.905)
SOT23-3N
  custom 0.5x1.2 smd: 1(0.95,1.143) 2(-0.95,1.143) 3(0,-1.143)
SOT23-5N
  custom 0.5x1.2 smd: 1(0.95,1.4) 2(0,1.4) 3(-0.95,1.4) 4(-0.95,-1.4) 5(0.95,-1.4)
SOT23-6N
  custom 0.5x1.2 smd: 1(0.95,1.4) 2(0,1.4) 3(-0.95,1.4) 4(-0.95,-1.4) 5(0,-1.4) 6(0.95,-1.4)
SOT23-8N
  custom 0.4x1.2 smd: 1(0.975,1.397) 2(0.325,1.397) 3(-0.325,1.397) 4(-0.975,1.397) 5(-0.975,-1.397) 6(-0.325,-1.397) 7(0.325,-1.397) 8(0.975,-1.397)
SOT89_N
  custom 0.65x1.4 smd: 1(1.5,1.952) 3(-1.5,1.952)
  custom 0.65x2.1 smd: 2(0,1.625)
  custom 1.755x3.055 smd: 4(0,-1.016)
SOT223_N
  custom 2.4x1 smd: 1(2.9,-2.3) 2(2.9,0) 3(2.9,2.3)
  rect 2.4x3.3 smd: 4(-2.9,0)
SSO-8_L5.9-W6.8-P1.27-LS11.5-BL
  oval 0.65x2.216 smd: 1(-1.905,-5.359) 2(-0.635,-5.359) 3(0.635,-5.359) 4(1.905,-5.359) 5(1.905,5.359) 6(0.635,5.359) 7(-0.635,5.359) 8(-1.905,5.359)
SSOP8_N
  custom 1.4x0.35 smd: 1(3.2,-0.975) 2(3.2,-0.325) 3(3.2,0.325) 4(3.2,0.975) 5(-3.2,0.975) 6(-3.2,0.325) 7(-3.2,-0.325) 8(-3.2,-0.975)
TO252
  rect 1.524x2.921 smd: 1(2.275,3.042)
  rect 5.842x6.223 smd: 2(0,-4.2)
  rect 1.524x2.794 smd: 3(-2.247,3.067)
TO-252-5_L6.6-W5.8-P1.27-TL
  rect 2.2x0.826 smd: 1(-3.543,2.54) 2(-3.543,1.27) 3(-3.543,0) 4(-3.543,-1.27) 5(-3.543,-2.54)
  rect 6.21x6.21 smd: 6(3.543,0)
TO-263-5_L10.2-W9.2-P1.70-LS15.2-TL
  rect 4x1.2 smd: 1(-4.85,3.42) 2(-4.85,1.71) 3(-4.85,0) 4(-4.85,-1.71) 5(-4.85,-3.42)
  rect 9.5x10.608 smd: 6(4.85,0)
TQFP48 7X7_N
  custom 0.3x1.799 smd: 1(2.75,4.073) 2(2.25,4.073) 3(1.75,4.073) 4(1.25,4.073) 5(0.75,4.073) 6(0.25,4.073) 7(-0.25,4.073) 8(-0.75,4.073) 9(-1.25,4.073) 10(-1.75,4.073) 11(-2.25,4.073) 12(-2.75,4.073) 25(-2.75,-4.073) 26(-2.25,-4.073) 27(-1.75,-4.073) 28(-1.25,-4.073) 29(-0.75,-4.073) 30(-0.25,-4.073) 31(0.25,-4.073) 32(0.75,-4.073) 33(1.25,-4.073) 34(1.75,-4.073) 35(2.25,-4.073) 36(2.75,-4.073)
  custom 1.799x0.3 smd: 13(-4.073,2.75) 14(-4.073,2.25) 15(-4.073,1.75) 16(-4.073,1.25) 17(-4.073,0.75) 18(-4.073,0.25) 19(-4.073,-0.25) 20(-4.073,-0.75) 21(-4.073,-1.25) 22(-4.073,-1.75) 23(-4.073,-2.25) 24(-4.073,-2.75) 37(4.073,-2.75) 38(4.073,-2.25) 39(4.073,-1.75) 40(4.073,-1.25) 41(4.073,-0.75) 42(4.073,-0.25) 43(4.073,0.25) 44(4.073,0.75) 45(4.073,1.25) 46(4.073,1.75) 47(4.073,2.25) 48(4.073,2.75)
TQFP64 10X10_N
  custom 0.3x1.799 smd: 1(3.75,5.574) 2(3.25,5.574) 3(2.75,5.574) 4(2.25,5.574) 5(1.75,5.574) 6(1.25,5.574) 7(0.75,5.574) 8(0.25,5.574) 9(-0.25,5.574) 10(-0.75,5.574) 11(-1.25,5.574) 12(-1.75,5.574) 13(-2.25,5.574) 14(-2.75,5.574) 15(-3.25,5.574) 16(-3.75,5.574) 33(-3.75,-5.574) 34(-3.25,-5.574) 35(-2.75,-5.574) 36(-2.25,-5.574) 37(-1.75,-5.574) 38(-1.25,-5.574) 39(-0.75,-5.574) 40(-0.25,-5.574) 41(0.25,-5.574) 42(0.75,-5.574) 43(1.25,-5.574) 44(1.75,-5.574) 45(2.25,-5.574) 46(2.75,-5.574) 47(3.25,-5.574) 48(3.75,-5.574)
  custom 1.799x0.3 smd: 17(-5.574,3.75) 18(-5.574,3.25) 19(-5.574,2.75) 20(-5.574,2.25) 21(-5.574,1.75) 22(-5.574,1.25) 23(-5.574,0.75) 24(-5.574,0.25) 25(-5.574,-0.25) 26(-5.574,-0.75) 27(-5.574,-1.25) 28(-5.574,-1.75) 29(-5.574,-2.25) 30(-5.574,-2.75) 31(-5.574,-3.25) 32(-5.574,-3.75) 49(5.574,-3.75) 50(5.574,-3.25) 51(5.574,-2.75) 52(5.574,-2.25) 53(5.574,-1.75) 54(5.574,-1.25) 55(5.574,-0.75) 56(5.574,-0.25) 57(5.574,0.25) 58(5.574,0.75) 59(5.574,1.25) 60(5.574,1.75) 61(5.574,2.25) 62(5.574,2.75) 63(5.574,3.25) 64(5.574,3.75)
TSSOP8_N
  custom 1.3x0.3 smd: 1(2,-0.975)
  custom 1.299x0.3 smd: 2(2,-0.325) 3(2,0.325) 4(2,0.975) 5(-2,0.975) 6(-2,0.325) 7(-2,-0.325) 8(-2,-0.975)
TSSOP-8_L4.4-W3.0-P0.65-LS6.4-BL
  oval 0.353x1.454 smd: 1(-0.975,-2.927) 2(-0.325,-2.927) 3(0.325,-2.927) 4(0.975,-2.927) 5(0.975,2.927) 6(0.325,2.927) 7(-0.325,2.927) 8(-0.975,2.927)
TSSOP-14_L5.0-W4.4-P0.65-LS6.4-BL
  rect 0.4x1.7 smd: 1(-1.95,-2.8) 2(-1.3,-2.8) 3(-0.65,-2.8) 4(0,-2.8) 5(0.65,-2.8) 6(1.3,-2.8) 7(1.95,-2.8) 8(1.95,2.8) 9(1.3,2.8) 10(0.65,2.8) 11(0,2.8) 12(-0.65,2.8) 13(-1.3,2.8) 14(-1.95,2.8)
TSSOP-20_L6.5-W4.4-P0.65-LS6.4-BL
  oval 0.364x1.742 smd: 1(-2.925,-2.871) 2(-2.275,-2.871) 3(-1.625,-2.871) 4(-0.975,-2.871) 5(-0.325,-2.871) 6(0.325,-2.871) 7(0.975,-2.871) 8(1.625,-2.871) 9(2.275,-2.871) 10(2.925,-2.871) 11(2.925,2.871) 12(2.275,2.871) 13(1.625,2.871) 14(0.975,2.871) 15(0.325,2.871) 16(-0.325,2.871) 17(-0.975,2.871) 18(-1.625,2.871) 19(-2.275,2.871) 20(-2.925,2.871)

## Nets
As in the schematic.

Pads without a net: 4*7 1 2; BGA-56 A1 A2 A3 A4 A5 A6 B1 B2 B3 B4 B5 B6 C1 C2 C3 C4 C5 C6 D1 D2 D3 D4 D5 D6 E1 E2 E5 E6 F1 F2 F5 F6 G1 G2 G3 G4 G5 G6 H1 H2 H3 H4 H5 H6 J1 J2 J3 J4 J5 J6 K1 K2 K3 K4 K5 K6; BGA-144 A1 A2 A3 A4 A5 A6 A7 A8 A9 A10 A11 A12 B1 B2 B3 B4 B5 B6 B7 B8 B9 B10 B11 B12 C1 C2 C3 C4 C5 C6 C7 C8 C9 C10 C11 C12 D1 D2 D3 D4 D5 D6 D7 D8 D9 D10 D11 D12 E1 E2 E3 E4 E5 E6 E7 E8 E9 E10 E11 E12 F1 F2 F3 F4 F5 F6 F7 F8 F9 F10 F11 F12 G1 G2 G3 G4 G5 G6 G7 G8 G9 G10 G11 G12 H1 H2 H3 H4 H5 H6 H7 H8 H9 H10 H11 H12 J1 J2 J3 J4 J5 J6 J7 J8 J9 J10 J11 J12 K1 K2 K3 K4 K5 K6 K7 K8 K9 K10 K11 K12 L1 L2 L3 L4 L5 L6 L7 L8 L9 L10 L11 L12 M1 M2 M3 M4 M5 M6 M7 M8 M9 M10 M11 M12; C2 1 2; C3 1 2; C4 1 2; C5 1 2; C6 1 2; C7 1 2; C8 1 2; C9 1 2; C10 1 2; D1 1 2; D2 1 2; DESIGNATOR59 1 2; DESIGNATOR60 1 2; DESIGNATOR61 1 2; DESIGNATOR62 1 2; DESIGNATOR63 1 2; DESIGNATOR64 1 2; DESIGNATOR65 1 2; DESIGNATOR66 1 2 3; DESIGNATOR67 1 2 3 4 5; DESIGNATOR68 1 2 3 4 5 6; DESIGNATOR69 1 2 3 4 5 6 7 8; DESIGNATOR70 1 2 3 4; DESIGNATOR71 1 2 3 4; DESIGNATOR72 1 2 3 4 5 6 7 8; DESIGNATOR73 1 2 3; DESIGNATOR74 1 2 3 4 5 6 7 8; DESIGNATOR76 1 2 3 4 5 6 7 8 9 10 11 12 13 14 15 16 17 18 19 20 21 22 23 24 25 26 27 28 29 30 31 32 33 34 35 36 37 38 39 40 41 42 43 44 45 46 47 48; DESIGNATOR77 1 2 3 4 5 6 7 8; DESIGNATOR79 1 2 3 4 5 6 7 8 9 10 11 12 13 14 15 16 17 18 19 20 21 22 23 24 25 26 27 28 29 30 31 32 33; DESIGNATOR80 1 2 3 4 5 6 7 8 9 10 11 12 13 14 15 16 17; DESIGNATOR84 1 2 3 4 5 6 7 8 9 10 11 12 13 14 15 16 17 18 19 20 21 22 23 24 25 26 27 28 29 30 31 32 33 34 35 36 37 38 39 40 41 42 43 44 45 46 47 48 49 50 51 52 53 54 55 56 57 58 59 60 61 62 63 64; DESIGNATOR85 1 2 3 4 5 6 7 8 9 10 11 12 13; L1 1 2; L2 1 2; L3 1 2; L4 1 2; L5 1 2; L6 1 2; L7 1 2; LGA-14 1 2 3 4 5 6 7 8 9 10 11 12 13 14; LGA-16 1 2 3 4 5 6 7 8 9 10 11 12 13 14 15 16; Q1 1 3 4; R1 1 2; R10 1 2; R11 1 2; R12 1 2; R13 1 2; R14 1 2; R15 1 2; R16 1 2; R17 1 2; REF1 1 2; RES1 1 2; U1 1 2 3 4 5 6; U2 1 2 3; U3 1 2; U4 1 2; U5 1 2; U6 1 2 3 4 5 6 7 8; U7 1 2 3 4 5 6 7 8 9 10 11 12 13 14; U8 1 2 3 4 5 6 7 8 9 10 11 12 13 14 15 16 17 18 19 20 21 22 23 24 25 26 27 28 29 30 31 32 33 34 35 36 37 38 39 40 41 42 43 44 45 46 47 48 49 50 51 52 53 54 55 56 57 58 59 60 61 62 63 64 65 66 67 68 69 70 71 72 73 74 75 76 77 78 79 80; U9 1 2 3 4 5 6 7 8 9 10 11 12 13 14 15 16 17 18 19 20 21 22 23 24 25 26 27 28 29 30 31 32 33 34 35 36 37 38 39 40 41 42 43 44 45 46 47 48; U10 1 2 3 4 5 6 7 8 9 10 11 12 13 14 15 16 17 18 19 20 21 22 23 24 25 26 27 28 29 30 31 32 33 34 35 36 37 38 39 40 41 42 43 44 45 46 47 48 49 50 51 52 53 54 55 56 57 58 59 60 61 62 63 64 65 66 67 68 69 70 71 72 73 74 75 76 77 78 79 80 81 82 83 84 85 86 87 88 89 90 91 92 93 94 95 96 97 98 99 100 101 102 103 104 105 106 107 108 109 110 111 112 113 114 115 116 117 118 119 120 121 122 123 124 125 126 127 128 129 130 131 132 133 134 135 136 137 138 139 140 141 142 143 144; U11 1 2 3; U12 A1 A2 A3 A4 A5 A6 A7 A8 A9 A10 A11 A12 A13 A14 B1 B2 B3 B4 B5 B6 B7 B8 B9 B10 B11 B12 B13 B14 C1 C2 C3 C4 C5 C6 C7 C8 C9 C10 C11 C12 C13 C14 D1 D2 D3 D4 D5 D10 D11 D12 D13 D14 E1 E2 E3 E4 E11 E12 E13 E14 F1 F2 F3 F12 F13 F14 G1 G2 G3 G12 G13 G14 H1 H2 H3 H12 H13 H14 J1 J2 J3 J12 J13 J14 K1 K2 K3 K4 K11 K12 K13 K14 L1 L2 L3 L4 L5 L10 L11 L12 L13 L14 M1 M2 M3 M4 M5 M6 M7 M8 M9 M10 M11 M12 M13 M14 N1 N2 N3 N4 N5 N6 N7 N8 N9 N10 N11 N12 N13 N14 P1 P2 P3 P4 P5 P6 P7 P8 P9 P10 P11 P12 P13 P14; U13 1 2 3; U14 1 2 3 4 5 6 7 8; U15 1 2 3 4 5 6 7 8; U16 1 2 3 4 5 6; U17 1 2 3 4 5 6; U18 1 2 3 4 5 6 7 8 9 10 11 12 13 14 15 16 17 18 19 20; U19 1 2 3 4 5 6 7 8; U20 1 2 3 4 5 6 7 8 9 10 11 12 13 14

## Routing (per net, layer and track width the routed paths; a pad name or vN(x,y) marks a point on that pad's centre or on a via; arc(x,y) is an arc through that point)
S$49: length 218
  Top Layer w0.381: 70.28,97.21 70.28,99.21 ; 32.22,97.22 32.22,99.22 ; 50.28,97.21 50.28,99.21 ; 10.22,97.22 10.22,99.22 ; 52.28,97.21 52.28,99.21 ; 86.22,97.2 86.22,99.2 ; 48.28,97.21 48.28,99.21 ; 90.22,97.2 90.22,99.2 ; 85.31,95.31 85.31,99.31 ; 53.28,97.21 53.28,99.21 ; 24.22,97.22 24.22,99.22 ; 83.28,97.21 83.28,99.21 ; 63.28,97.21 63.28,99.21 ; 61.28,97.21 61.28,99.21 ; 77.28,97.21 77.28,99.21 ; 72.28,97.21 72.28,99.21 ; 79.28,97.21 79.28,99.21 ; 64.28,97.21 64.28,99.21 ; 45.26,95.31 45.26,99.31 ; 11.22,97.22 11.22,99.22 ; 36.22,97.22 36.22,99.22 ; 75.23,95.31 75.23,99.31 ; 85.31,95.3 85.31,99.3 ; 60.28,97.21 60.28,99.21 ; 95.17,95.3 95.17,99.3 ; 21.22,97.22 21.22,99.22 ; 94.22,97.2 94.22,99.2 ; 14.22,97.22 14.22,99.22 ; 76.28,97.21 76.28,99.21 ; 26.22,97.22 26.22,99.22 ; 43.22,97.22 43.22,99.22 ; 65.37,95.31 65.37,99.31 ; 66.28,97.21 66.28,99.21 ; 39.22,97.22 39.22,99.22 ; 57.28,97.21 57.28,99.21 ; 19.22,97.22 19.22,99.22 ; 37.22,97.22 37.22,99.22 ; 51.28,97.21 51.28,99.21 ; 58.28,97.21 58.28,99.21 ; 20.22,97.22 20.22,99.22 ; 42.22,97.22 42.22,99.22 ; 82.28,97.21 82.28,99.21 ; 7.22,97.22 7.22,99.22 ; 29.22,97.22 29.22,99.22 ; 80.28,97.21 80.28,99.21 ; 92.22,97.2 92.22,99.2 ; 18.22,97.22 18.22,99.22 ; 87.22,97.2 87.22,99.2 ; 91.22,97.2 91.22,99.2 ; 28.22,97.22 28.22,99.22 ; 93.22,97.2 93.22,99.2 ; 44.22,97.22 44.22,99.22 ; 67.28,97.21 67.28,99.21 ; 81.28,97.21 81.28,99.21 ; 23.22,97.22 23.22,99.22 ; 5.21,95.31 5.21,99.31 ; 45.26,95.22 45.26,99.22 ; 34.22,97.22 34.22,99.22 ; 73.28,97.21 73.28,99.21 ; 56.28,97.21 56.28,99.21 ; 62.28,97.21 62.28,99.21 ; 45.26,95.31 45.26,99.31 ; 30.22,97.22 30.22,99.22 ; 12.22,97.22 12.22,99.22 ; 78.28,97.21 78.28,99.21 ; 88.22,97.2 88.22,99.2 ; 33.22,97.22 33.22,99.22 ; 46.28,97.21 46.28,99.21 ; 13.22,97.22 13.22,99.22 ; 85.31,95.21 85.31,99.21 ; 25.32,95.31 25.32,99.31 ; 31.22,97.22 31.22,99.22 ; 16.22,97.22 16.22,99.22 ; 84.28,97.21 84.28,99.21 ; 71.28,97.21 71.28,99.21 ; 89.22,97.2 89.22,99.2 ; 55.29,95.31 55.29,99.31 ; 9.22,97.22 9.22,99.22 ; 41.22,97.22 41.22,99.22 ; 27.22,97.22 27.22,99.22 ; 17.22,97.22 17.22,99.22 ; 40.22,97.22 40.22,99.22 ; 49.28,97.21 49.28,99.21 ; 22.22,97.22 22.22,99.22 ; 68.28,97.21 68.28,99.21 ; 6.22,97.22 6.22,99.22 ; 74.28,97.21 74.28,99.21 ; 47.28,97.21 47.28,99.21 ; 59.28,97.21 59.28,99.21 ; 54.28,97.21 54.28,99.21 ; 8.22,97.22 8.22,99.22 ; 38.22,97.22 38.22,99.22 ; 35.18,95.31 35.18,99.31 ; 69.28,97.21 69.28,99.21 ; 15.24,95.31 15.24,99.31

## Copper pours and planes (outline as drawn; the poured copper is in the pictures)
GND on Top Layer: -9.53,106.55 105.79,106.55 109.85,102.49 109.85,1.14 99.19,-9.53 -5.72,-9.53 -9.02,-6.22 -9.02,-5.97
GND on Bottom Layer: -9.78,109.09 106.55,109.09 110.36,105.28 110.36,-8 106.81,-11.56 -5.72,-11.56 -8.25,-9.02

## Text on the board
Bottom Silkscreen Layer: 50mil | 0 | 3500 | 3000 | 2500 | 2000 | 1500 | 1000 | 500 | TSSOP-8 | TSSOP-14 | TSSOP-20 | SSO-8 | TO252-5 | TO263-5 | SO-8 | DPAK-3 | TO263-3 | TO252-3 | BGA-144 | 10mil | 100mil | 20mil | 6mil | 60mil | 80mil | 40mil | 1OZ  电流 线宽 / 0.2A    0.15mm - 5.9mil / 0.55A  0.2mm  - 7.8mil / 0.8A    0.3mm  - 11.8mil / 1.1A    0.4mm  - 15.7mil | 1.35A  0.5mm - 19.6mil / 1.6A    0.6mm - 23.6mil / 2.0A    0.8mm - 31.4mil / 2.3A    1mm   -- 39.3mil | LQFP-144/80/48
Top Silkscreen Layer: SMA | cm | 0 | 1 | 2 | 3 | 4 | 5 | 6 | 7 | 8 | 9 | SOT23-3 | SOT23-5 | SOT23-6 | SOT23-8 | (3*3) | (4) | (3) | (5) | (4*4) | M1 | M2 | M3 | M4 | M5 | (6.3) | (5*5) | (8) | SOD-323 | SOD-123 | (6*6) | SMC | SMB | (10) | (7.3*7.3) | (12.5) | B型3528 | D型7343 | C型6032 | A型3216 | (8*8) | (16) | (12*12) | SOIC-8 | SOIC-14 | 贴片型（）内为电容体直径 | 直插型（）内为电容体直径 | 0402 | 1206 | 1210 | 1812 | 0201 | 0603 | 0805 | QFN12 | SOT89 | TSSOP8 | TQFP48 | TO263-5 | QFN16 | SOT223 | SSOP8 | 2010 | 2512 | 2816 | TQFP64 | TO220-3 | QFN32 | TO252 | SOP8 | 电解电容 | 功率电感 | 螺孔 | 二极管 | 钽电容 | IC | 常见封装 | 电阻/容/感
